# Altium schematic sheet STM32_H750_POWER.SchDoc
size A4; SheetNumber: 1; SheetTotal: 3
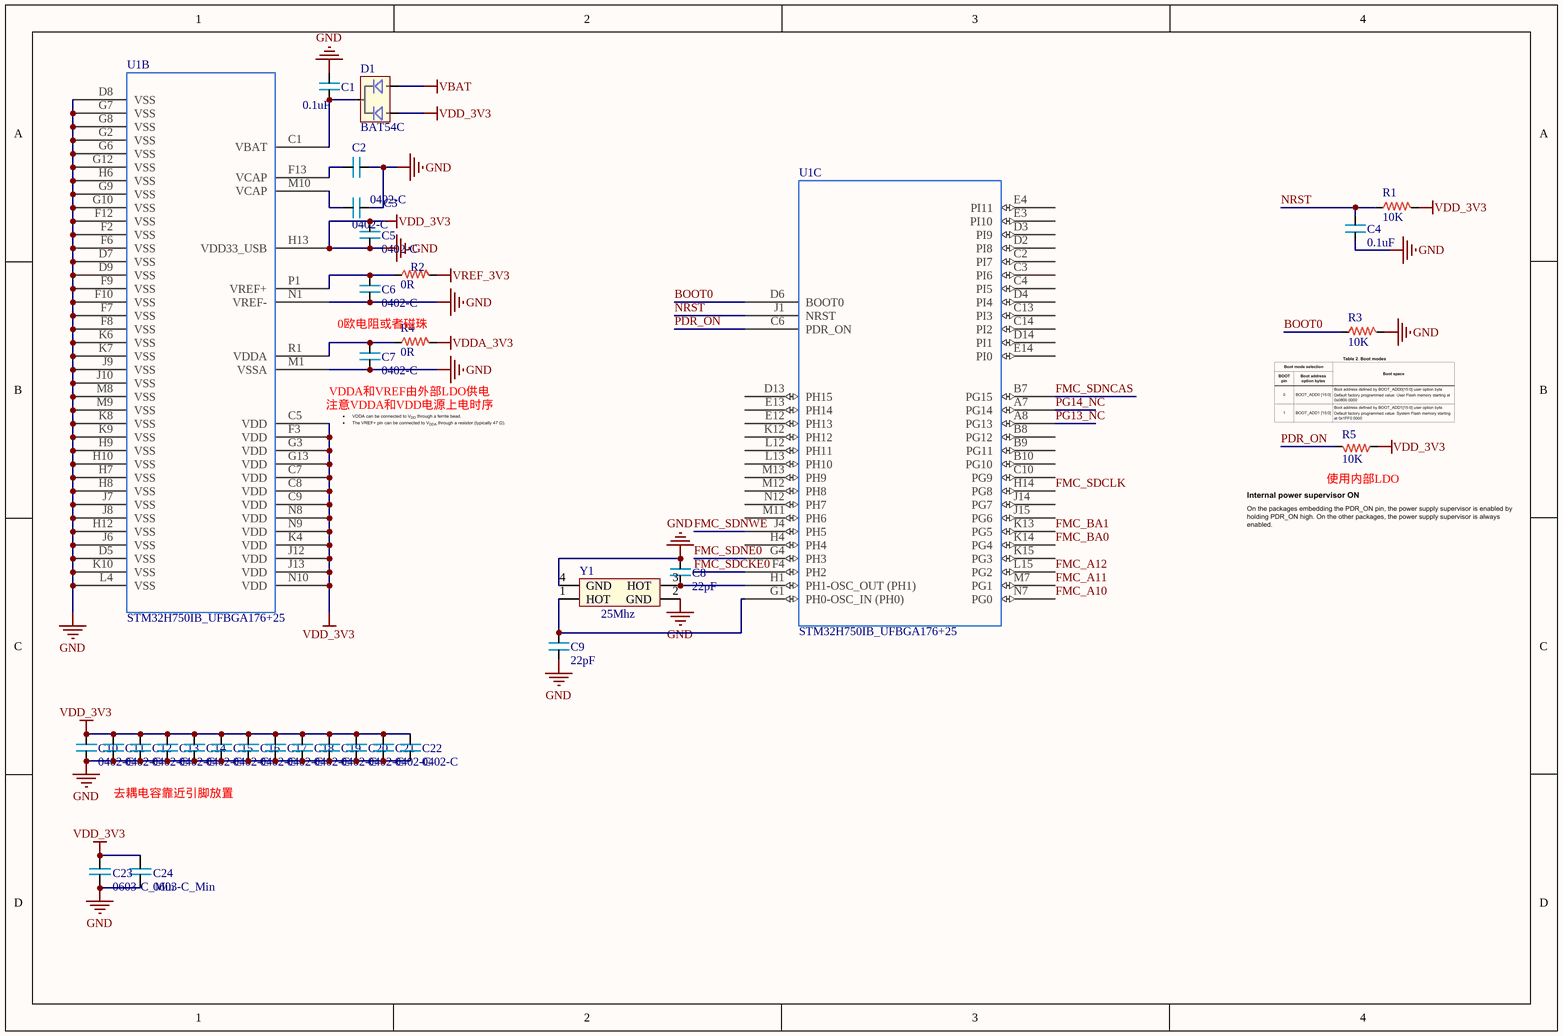
[diagram p0: STM32_H750_POWER.SchDoc]

## Parts
C1  0.1uF  [0402]
C2  0402-C  [0402]
C3  0402-C  [0402]
C4  0.1uF  [0402]
C5  0402-C  [0402]
C6  0402-C  [0402]
C7  0402-C  [0402]
C8  22pF  [0402]
C9  22pF  [0402]
C10  0402-C  [0402]
C11  0402-C  [0402]
C12  0402-C  [0402]
C13  0402-C  [0402]
C14  0402-C  [0402]
C15  0402-C  [0402]
C16  0402-C  [0402]
C17  0402-C  [0402]
C18  0402-C  [0402]
C19  0402-C  [0402]
C20  0402-C  [0402]
C21  0402-C  [0402]
C22  0402-C  [0402]
C23  0603-C_Min  [0603P - 2]
C24  0603-C_Min  [0603P - 2]
D1  BAT54C  [SOT23-3]
R1  10K  [0402]
R2  0R  [0402]
R3  10K  [0402]
R4  0R  [0402]
R5  10K  [0402]
U1  STM32H750IB_UFBGA176+25  [STM32H750IB_UFBGA176+25]  (parts B,C of 3)
Y1  25Mhz  [XTAL3225]

## Nets
GND: C1.2 C2.1 C3.2 C4.1 C5.1 C5.2 C6.1 C7.1 C8.2 C9.2 C10.1 C10.2 C11.1 C11.2 C12.1 C12.2 C13.1 C13.2 C14.1 C14.2 C15.1 C15.2 C16.1 C16.2 C17.1 C17.2 C18.1 C18.2 C19.1 C19.2 C20.1 C20.2 C21.1 C21.2 C22.1 C22.2 C23.1 C23.2 C24.1 C24.2 D1.1 R1.2 R3.2 R5.1 U1.C5(VDD) U1.C7(VDD) U1.C8(VDD) U1.C9(VDD) U1.D5(VSS) U1.D7(VSS) U1.D8(VSS) U1.D9(VSS) U1.F2(VSS) U1.F3(VDD) U1.F6(VSS) U1.F7(VSS) U1.F8(VSS) U1.F9(VSS) U1.F10(VSS) U1.F12(VSS) U1.G2(VSS) U1.G3(VDD) U1.G6(VSS) U1.G7(VSS) U1.G8(VSS) U1.G9(VSS) U1.G10(VSS) U1.G12(VSS) U1.G13(VDD) U1.H6(VSS) U1.H7(VSS) U1.H8(VSS) U1.H9(VSS) U1.H10(VSS) U1.H12(VSS) U1.H13(VDD33_USB) U1.J6(VSS) U1.J7(VSS) U1.J8(VSS) U1.J9(VSS) U1.J10(VSS) U1.J12(VDD) U1.J13(VDD) U1.K4(VDD) U1.K6(VSS) U1.K7(VSS) U1.K8(VSS) U1.K9(VSS) U1.K10(VSS) U1.L4(VSS) U1.M1(VSSA) U1.M8(VSS) U1.M9(VSS) U1.N1(VREF-) U1.N8(VDD) U1.N9(VDD) U1.N10(VDD) Y1.2(GND) Y1.4(GND)  [also labelled VDD_3V3]
VBAT: D1.2
VDDA_3V3: R4.2
VREF_3V3: R2.2
BOOT0: R3.1 U1.D6(BOOT0)
FMC_A10: U1.N7(PG0)
FMC_A11: U1.M7(PG1)
FMC_A12: U1.L15(PG2)
FMC_BA0: U1.K14(PG4)
FMC_BA1: U1.K13(PG5)
FMC_SDCKE0: U1.F4(PH2)
FMC_SDCLK: U1.H14(PG8)
FMC_SDNCAS: U1.B7(PG15)
FMC_SDNE0: U1.G4(PH3)
FMC_SDNWE: U1.J4(PH5)
NRST: C4.2 R1.1 U1.J1(NRST)
PDR_ON: R5.2 U1.C6(PDR_ON)
PG13_NC: U1.A8(PG13)
PG14_NC: U1.A7(PG14)
NetC1_1: C1.1 D1.3 U1.C1(VBAT)
NetC2_2: C2.2 U1.F13(VCAP)
NetC3_1: C3.1 U1.M10(VCAP)
NetC6_2: C6.2 R2.1 U1.P1(VREF+)
NetC7_2: C7.2 R4.1 U1.R1(VDDA)
NetC8_1: C8.1 U1.H1(PH1-OSC_OUT_(PH1)) Y1.3(HOT)
NetC9_1: C9.1 U1.G1(PH0-OSC_IN_(PH0)) Y1.1(HOT)

Not connected (* = marked no-connect by the designer): U1 B8(PG12) B9(PG11) B10(PG10) C2(PI7) C3(PI6) C4(PI5) C10(PG9) C13(PI3) C14(PI2) D2(PI8) D3(PI9) D4(PI4) D13(PH15) D14(PI1) E3(PI10) E4(PI11) E12(PH13) E13(PH14) E14(PI0) H4(PH4) J14(PG7) J15(PG6) K12(PH12) K15(PG3) L12(PH11) L13(PH10) M11(PH6) M12(PH8) M13(PH9) N12(PH7)

## Notes on the sheet
- 0欧电阻或者磁珠
- (near C7) VDDA和VREF由外部LDO供电
- 注意VDDA和VDD电源上电时序
- (near R5) 使用内部LDO
- 去耦电容靠近引脚放置

## Library data of the parts
C1 C4 C8 C9 = 0402-C
D1 = BAT54C: 双肖特基二极管
R1-R5 = 0402-R
Y1 = XTAL_3225: 3225贴片无源晶振
U1 = STM32H750IB_UFBGA176+25: ComponentLink1Description: New link; ComponentLink1URL: *